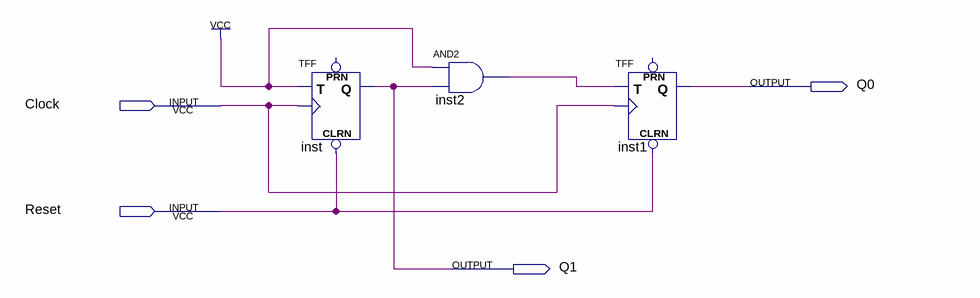
[diagram p0: schematic sheet]
// Quartus schematic Up_Counter.bdf as structural Verilog: 3 symbols, 4 pins
module Up_Counter (
  input  Clock,
  input  Reset,
  output Q0,
  output Q1
);

  wire inst2_out;

  TFF inst (.CLRN(Reset), .T(1'b1), .CLK(Clock), .Q(Q1));  // open: PRN
  and inst2 (inst2_out, 1'b1, Q1);
  TFF inst1 (.CLRN(Reset), .T(inst2_out), .CLK(Clock), .Q(Q0));  // open: PRN
endmodule
